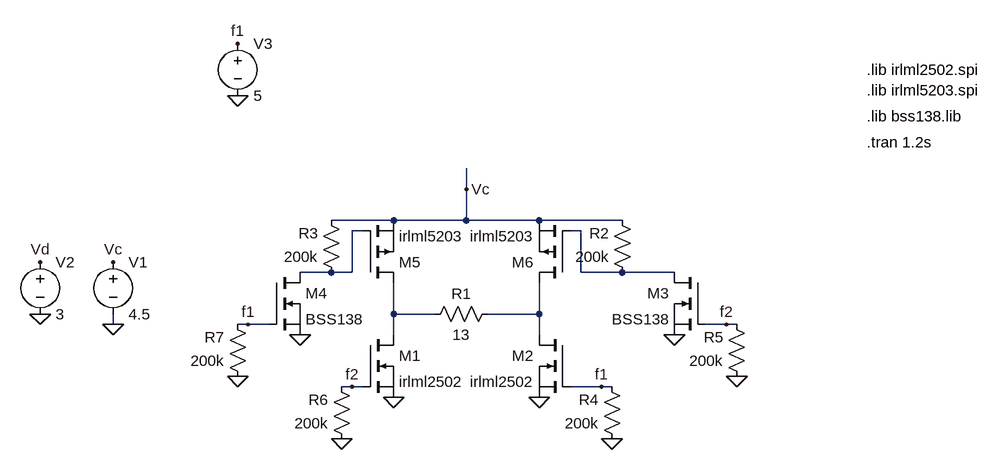
[diagram p0: schematic model.asc]
model.asc, the LTspice schematic file:
Version 4
SHEET 1 1196 680
WIRE 400 176 400 144
WIRE 288 224 192 224
WIRE 400 224 400 176
WIRE 400 224 288 224
WIRE 512 224 400 224
WIRE 640 224 512 224
WIRE 240 240 224 240
WIRE 576 240 560 240
WIRE 192 304 144 304
WIRE 224 304 224 240
WIRE 224 304 192 304
WIRE 576 304 576 240
WIRE 640 304 576 304
WIRE 720 304 640 304
WIRE 288 368 288 320
WIRE 352 368 288 368
WIRE 512 368 512 320
WIRE 512 368 432 368
WIRE -144 384 -144 368
WIRE 64 384 48 384
WIRE 96 384 64 384
WIRE 800 384 768 384
WIRE 816 384 800 384
WIRE 288 400 288 368
WIRE 512 400 512 368
WIRE 224 480 208 480
WIRE 240 480 224 480
WIRE 608 480 560 480
WIRE 624 480 608 480
FLAG -144 384 0
FLAG 144 400 0
FLAG 288 496 0
FLAG 512 496 0
FLAG 720 400 0
FLAG -144 288 Vc
FLAG 400 176 Vc
FLAG -256 368 0
FLAG -256 288 Vd
FLAG 48 464 0
FLAG 208 560 0
FLAG 624 560 0
FLAG 816 464 0
FLAG 48 32 0
FLAG 48 -48 f1
FLAG 64 384 f1
FLAG 224 480 f2
FLAG 608 480 f1
FLAG 800 384 f2
SYMBOL nmos 240 400 R0
SYMATTR InstName M1
SYMATTR Value irlml2502
SYMATTR Prefix X
SYMBOL nmos 560 400 M0
SYMATTR InstName M2
SYMATTR Value irlml2502
SYMATTR Prefix X
SYMBOL nmos 768 304 M0
SYMATTR InstName M3
SYMATTR Value BSS138
SYMATTR Prefix X
SYMBOL nmos 96 304 R0
SYMATTR InstName M4
SYMATTR Value BSS138
SYMATTR Prefix X
SYMBOL pmos 240 320 M180
SYMATTR InstName M5
SYMATTR Value irlml5203
SYMATTR Prefix X
SYMBOL pmos 560 320 R180
SYMATTR InstName M6
SYMATTR Value irlml5203
SYMATTR Prefix X
SYMBOL res 448 352 R90
WINDOW 0 0 56 VBottom 2
WINDOW 3 32 56 VTop 2
SYMATTR InstName R1
SYMATTR Value 13
SYMBOL res 656 320 R180
WINDOW 0 36 76 Left 2
WINDOW 3 36 40 Left 2
SYMATTR InstName R2
SYMATTR Value 200k
SYMBOL res 208 320 R180
WINDOW 0 36 76 Left 2
WINDOW 3 36 40 Left 2
SYMATTR InstName R3
SYMATTR Value 200k
SYMBOL voltage -144 272 R0
SYMATTR InstName V1
SYMATTR Value 4.5
SYMBOL voltage -256 272 R0
SYMATTR InstName V2
SYMATTR Value 3
SYMBOL res 640 576 R180
WINDOW 0 36 76 Left 2
WINDOW 3 36 40 Left 2
SYMATTR InstName R4
SYMATTR Value 200k
SYMBOL res 832 480 R180
WINDOW 0 36 76 Left 2
WINDOW 3 36 40 Left 2
SYMATTR InstName R5
SYMATTR Value 200k
SYMBOL res 224 576 R180
WINDOW 0 36 76 Left 2
WINDOW 3 36 40 Left 2
SYMATTR InstName R6
SYMATTR Value 200k
SYMBOL res 64 480 R180
WINDOW 0 36 76 Left 2
WINDOW 3 36 40 Left 2
SYMATTR InstName R7
SYMATTR Value 200k
SYMBOL voltage 48 -64 R0
SYMATTR InstName V3
SYMATTR Value 5
TEXT 1016 64 Left 2 !.lib bss138.lib
TEXT 1016 104 Left 2 !.tran 1.2s
TEXT 1016 24 Left 2 !.lib irlml5203.spi
TEXT 1016 -8 Left 2 !.lib irlml2502.spi

The netlist it stands for:
* model.asc
XM1 N003 f2 0 irlml2502  ; pins D G S
XM2 N004 f1 0 irlml2502  ; pins D G S
XM3 N002 f2 0 BSS138  ; pins D G S
XM4 N001 f1 0 BSS138  ; pins D G S
XM5 N003 N001 Vc irlml5203  ; pins D G S
XM6 N004 N002 Vc irlml5203  ; pins D G S
R1 N004 N003 13
R2 N002 Vc 200k
R3 N001 Vc 200k
V1 Vc 0 4.5
V2 Vd 0 3
R4 0 f1 200k
R5 0 f2 200k
R6 0 f2 200k
R7 0 f1 200k
V3 f1 0 5
.lib bss138.lib
.tran 1.2s
.lib irlml5203.spi
.lib irlml2502.spi
.backanno
.end